# Altium project PCB_Project.PrjPcb
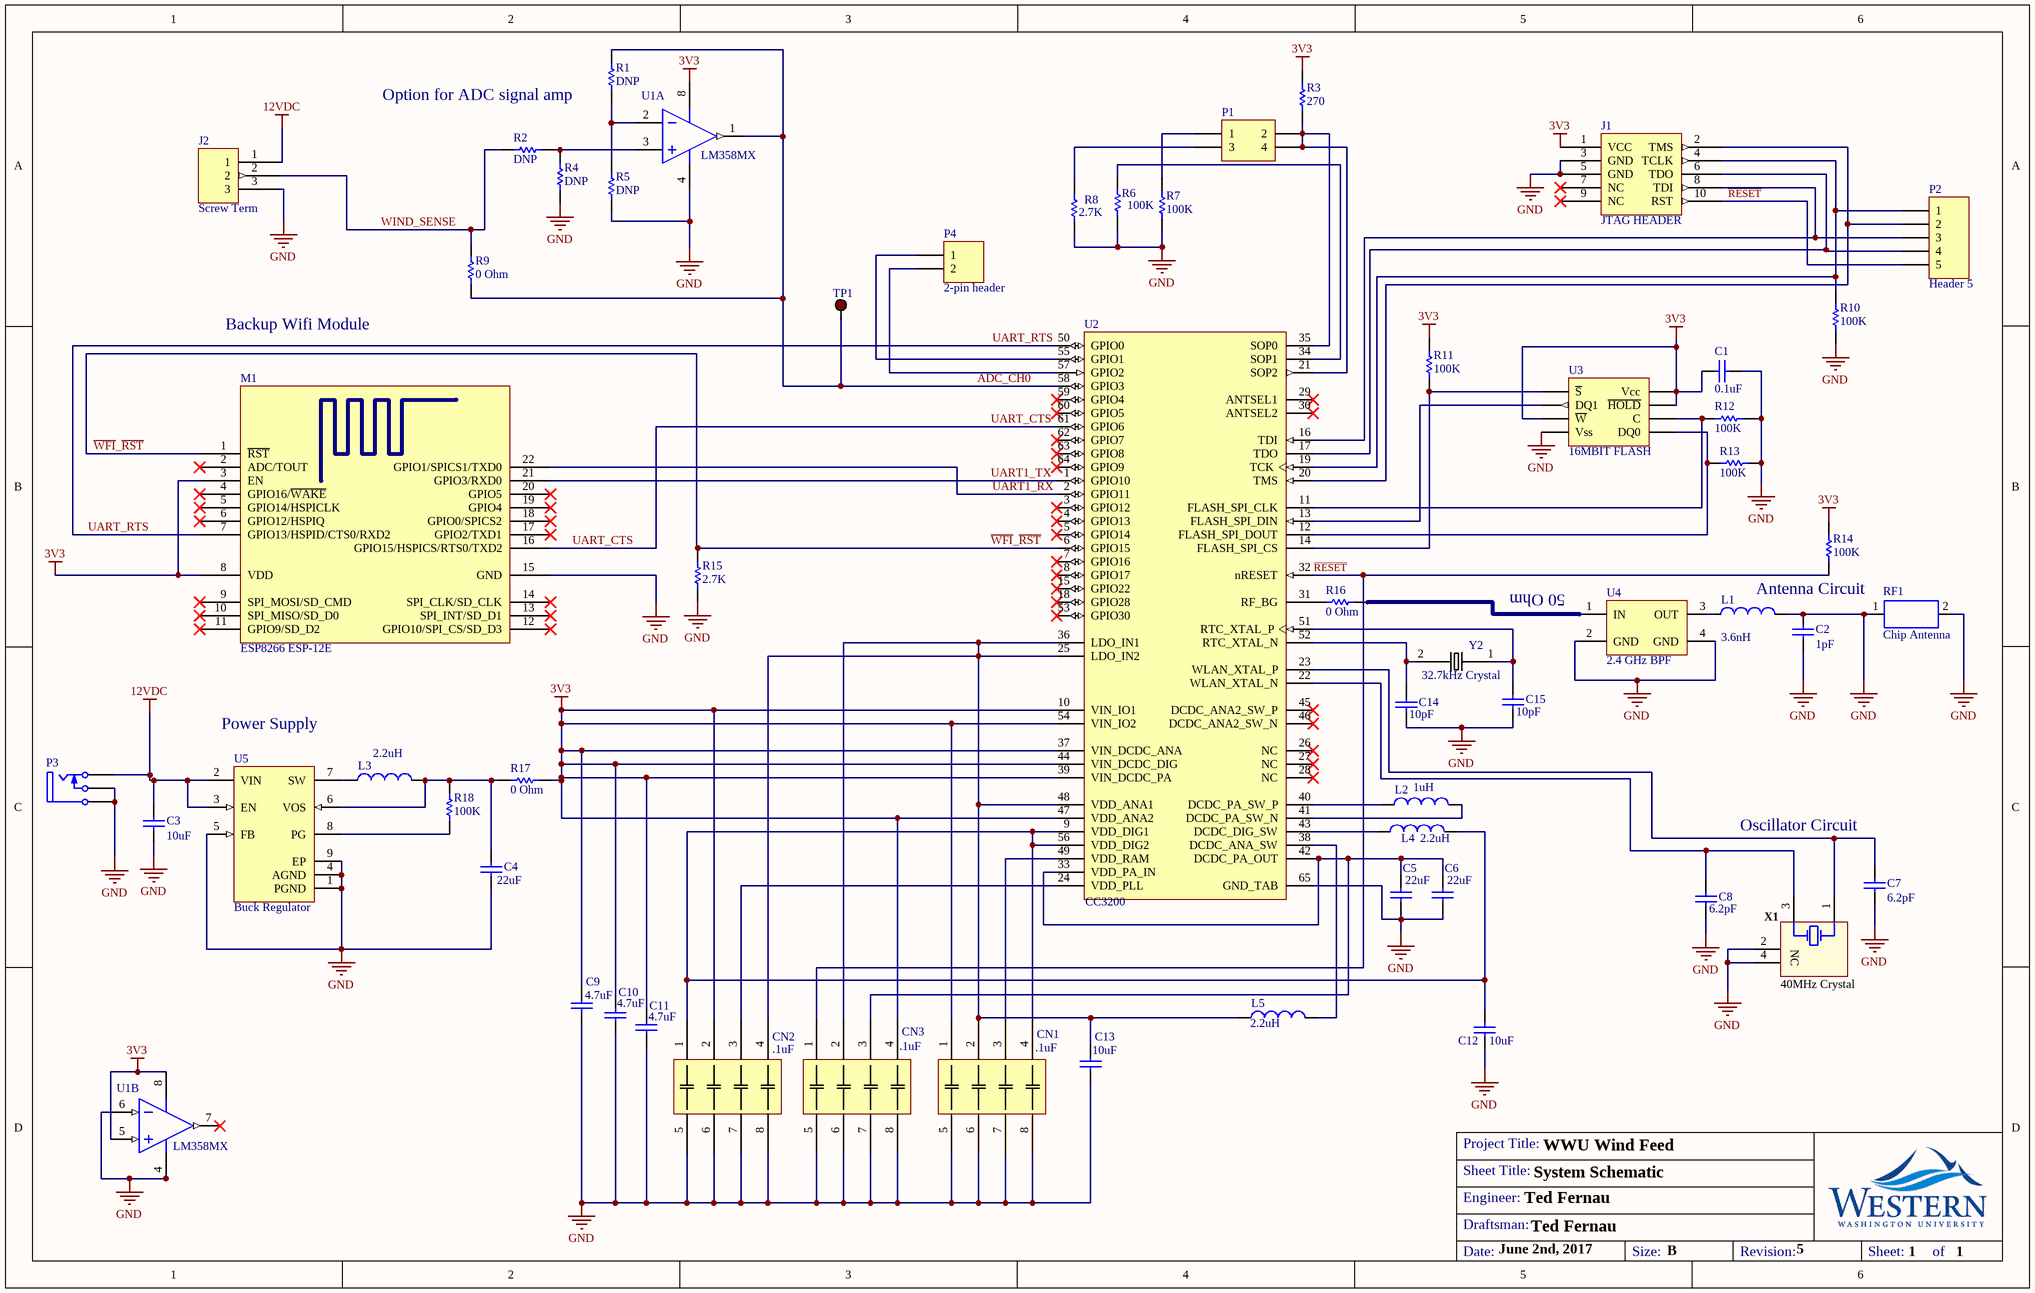
[diagram p0: System_wired.SchDoc]
RevNumber: 5; GlobalTitle: WWU Wind Feed; GlobalDate: June 2nd, 2017; EngineerName: Ted Fernau; DraftsmanName: Ted Fernau
1 sheet, 57 parts. Net scope: flat (ports and power ports of the same name join across sheets).
Board file: PCB2.PcbDoc

## Sheet System_wired.SchDoc: System Schematic
size B; Date: [Date]; Engineer: Ted Fernau; SheetNumber: 1; SheetTotal: 1; PageSetup: Record=PageOptions|CenterHorizontal=True|CenterVertical=True|PrintScale=1.09|XCorrection=1.00|YCorrection=1.00|PrintKind=1|BorderSize=5000000|LeftOffset=0|BottomOffset=0|Orientation=2|PaperLength=1000|PaperWidth=1000|Scale=100|PaperSource=15|PrintQuality=600|MediaType=1|DitherType=10|PrintScaleMode=1|PaperKind=11x17|PaperIndex=17

### Parts
C1  value 0.1uF  [CAPC0603(1608)100_M]  (hidden comment: CAP 10uF 10V 0603(1608))
C2  value 1pF  [CAPC0603(1608)100_M]  (hidden comment: CAP 10uF 10V 0603(1608))
C3  value 10uF  [CAPC0603(1608)100_M]  (hidden comment: CAP 10uF 10V 0603(1608))
C4  22uF  [CAPC0603(1608)100_L]
C5  value 22uF  [CAPC0603(1608)100_M]  (hidden comment: CAP 10uF 10V 0603(1608))
C6  value 22uF  [CAPC0603(1608)100_M]  (hidden comment: CAP 10uF 10V 0603(1608))
C7  value 6.2pF  [CAPC0603(1608)100_M]  (hidden comment: CAP 10uF 10V 0603(1608))
C8  value 6.2pF  [CAPC0603(1608)100_M]  (hidden comment: CAP 10uF 10V 0603(1608))
C9  value 4.7uF  [CAPC0603(1608)100_M]  (hidden comment: CAP 10uF 10V 0603(1608))
C10  value 4.7uF  [CAPC0603(1608)100_M]  (hidden comment: CAP 10uF 10V 0603(1608))
C11  value 4.7uF  [CAPC0603(1608)100_M]  (hidden comment: CAP 10uF 10V 0603(1608))
C12  value 10uF  [CAPC0603(1608)100_M]  (hidden comment: CAP 10uF 10V 0603(1608))
C13  value 10uF  [CAPC0603(1608)100_M]  (hidden comment: CAP 10uF 10V 0603(1608))
C14  value 10pF  [CAPC0603(1608)100_M]  (hidden comment: CAP 10uF 10V 0603(1608))
C15  value 10pF  [CAPC0603(1608)100_M]  (hidden comment: CAP 10uF 10V 0603(1608))
CN1  .1uF  [Cap. Array 0612]
CN2  .1uF  [Cap. Array 0612]
CN3  .1uF  [Cap. Array 0612]
J1  JTAG HEADER  [FTSH-105-01-L-DV-K]
J2  Screw Term  [SCREW TERM 3 PIN 3.5mm]
L1  value 3.6nH  [1608[0603]]  (hidden comment: Inductor)
L2  Inductance: 1uH  [TDK-IND0805-125_V]  (hidden comment: MLZ2012N100LT)
L3  Inductance: 2.2uH  [TDK-IND0805-125_V]  (hidden comment: MLZ2012N100LT)
L4  Inductance: 2.2uH  [TDK-IND0805-125_V]  (hidden comment: MLZ2012N100LT)
L5  Inductance: 2.2uH  [TDK-IND0805-125_V]  (hidden comment: MLZ2012N100LT)
M1  ESP8266 ESP-12E  [ESP8266 ESP-12-E]
P1  Header 2X2  [HDR2X2]  (value not drawn)
P2  Header 5  [HDR1X5]
P3  RASM722X  [SWIT-RASM722X_V]  (value not drawn)
P4  2-pin header  [HDR1X2]
R1  DNP  [RESC0603(1608)_N]
R2  DNP  [RESC0603(1608)_N]
R3  270  [RESC0805(2012)_L]
R4  DNP  [RESC0603(1608)_N]
R5  DNP  [RESC0603(1608)_N]
R6  100K  [RESC0805(2012)_L]
R7  100K  [RESC0805(2012)_L]
R8  2.7K  [RESC0805(2012)_L]
R9  0 Ohm  [RESC0603(1608)_N]
R10  100K  [RESC0805(2012)_L]
R11  100K  [RESC0805(2012)_L]
R12  100K  [RESC0805(2012)_L]
R13  100K  [RESC0805(2012)_L]
R14  100K  [RESC0805(2012)_L]
R15  2.7K  [RESC0805(2012)_L]
R16  0 Ohm  [RESC0603(1608)_N]
R17  0 Ohm  [RESC0603(1608)_N]
R18  100K  [RESC0805(2012)_L]
RF1  Chip Antenna  [TAYO-AH316M-2_N]
TP1  5001  [Keystone_5001]  (value not drawn)
U1  LM358MX  [M08A_L]  (parts A,B of 2)
U2  CC3200  [TI-RGC64-7300x7300TP_L]
U3  16MBIT FLASH  [8SOIC]
U4  2.4 GHz BPF  [TDK-DEA202450BT-1294C1-H_V]
U5  Buck Regulator  [DSG0008A_V]
X1  40MHz Crystal  [AVX-CX3225GB-4_V]
Y2  32.7kHz Crystal  [XTAL320X150X90]

### Nets
3V3: C1.2 C9.2 C10.2 C11.2 CN1.1 CN2.2 CN3.4 J1.1(VCC) M1.3(EN) M1.8(VDD) R3.2 R11.2 R14.2 R17.1 U1.5(INB+) U1.8(V+) U2.10(VIN_IO1) U2.37(VIN_DCDC_ANA) U2.39(VIN_DCDC_PA) U2.44(VIN_DCDC_DIG) U2.47(VDD_ANA2) U2.54(VIN_IO2) U3.3(~{W}) U3.7(~{HOLD}) U3.8(Vcc)
12VDC: C3.2 J2.1 P3.2(TIP) U5.2(VIN) U5.3(EN)
GND: C1.1 C2.1 C2.2 C3.1 C4.1 C5.2 C6.2 C7.1 C8.1 C9.1 C10.1 C11.1 C12.2 C13.2 C14.1 C15.1 CN1.5 CN1.6 CN1.7 CN1.8 CN2.5 CN2.6 CN2.7 CN2.8 CN3.5 CN3.6 CN3.7 CN3.8 J1.3(GND) J1.5(GND) J2.3 L1.2 M1.15(GND) P3.1(SLEEVE) P3.3(SHUNT) R4.1 R5.1 R6.1 R7.1 R8.1 R10.1 R12.1 R13.1 R15.1 RF1.1 RF1.2 U1.4(GND) U1.6(INB-) U2.65(GND_TAB) U3.4(Vss) U4.2(GND) U4.4(GND) U5.1(PGND) U5.4(AGND) U5.5(FB) U5.9(EP) X1.2(GND) X1.4(GND)
ADC_CH0: R1.2 R9.1 TP1.1(TP) U1.1(OUTA) U2.58(GPIO3)
~{RESET}: CN3.1 J1.10(RST) P2.5 R14.1 U2.32(nRESET)
UART1_RX: M1.22(GPIO1/SPICS1/TXD0) U2.2(GPIO11)
UART1_TX: M1.21(GPIO3/RXD0) U2.1(GPIO10)
UART_CTS: M1.16(GPIO15/HSPICS/RTS0/TXD2) U2.61(GPIO6)
UART_RTS: M1.7(GPIO13/HSPID/CTS0/RXD2) U2.50(GPIO0)
~{WFI}_~{RST}: M1.1(~{RST}) R15.2 U2.6(GPIO15)
WIND_SENSE: J2.2 R2.2 R9.2
NetC4_2: C4.2 L3.2 R17.2 R18.2 U5.6(VOS)
NetC5_1: C5.1 C6.1 CN3.3 U2.33(VDD_PA_IN) U2.42(DCDC_PA_OUT)
NetC7_2: C7.2 U2.23(WLAN_XTAL_P) X1.1(HOT)
NetC8_2: C8.2 U2.22(WLAN_XTAL_N) X1.3(HOT)
NetC12_1: C12.1 CN1.4 CN2.1 L4.2 U2.9(VDD_DIG1) U2.56(VDD_DIG2)
NetC13_1: C13.1 CN1.2 CN2.4 CN3.2 L5.1 U2.25(LDO_IN2) U2.36(LDO_IN1) U2.48(VDD_ANA1)
NetC14_2: C14.2 U2.52(RTC_XTAL_N) Y2.2
NetC15_2: C15.2 U2.51(RTC_XTAL_P) Y2.1
NetCN1_3: CN1.3 U2.49(VDD_RAM)
NetCN2_3: CN2.3 U2.24(VDD_PLL)
NetJ1_2: J1.2(TMS) P2.2 U2.20(TMS)
NetJ1_4: J1.4(TCLK) P2.1 R10.2 U2.19(TCK)
NetJ1_6: J1.6(TDO) P2.4 U2.17(TDO)
NetJ1_8: J1.8(TDI) P2.3 U2.16(TDI)
NetL1_1: L1.1 U4.3(OUT)
NetL2_1: L2.1 U2.40(DCDC_PA_SW_P)
NetL2_2: L2.2 U2.41(DCDC_PA_SW_N)
NetL3_1: L3.1 U5.7(SW)
NetL4_1: L4.1 U2.43(DCDC_DIG_SW)
NetL5_2: L5.2 U2.38(DCDC_ANA_SW)
NetP1_1: P1.1 R7.2
NetP1_2: P1.2 P1.4 R3.1 U2.21(SOP2) U2.35(SOP0)
NetP1_3: P1.3 R8.2
NetP4_1: P4.1 U2.55(GPIO1)
NetP4_2: P4.2 U2.57(GPIO2)
NetR1_1: R1.1 R5.2 U1.2(INA-)
NetR2_1: R2.1 R4.2 U1.3(INA+)
NetR6_2: R6.2 U2.34(SOP1)
NetR11_1: R11.1 U2.14(FLASH_SPI_CS) U3.1(~{S})
NetR12_2: R12.2 U2.11(FLASH_SPI_CLK) U3.6(C)
NetR13_2: R13.2 U2.12(FLASH_SPI_DOUT) U3.5(DQ0)
NetR16_1: R16.1 U4.1(IN)
NetR16_2: R16.2 U2.31(RF_BG)
NetR18_1: R18.1 U5.8(PG)
NetU2_13: U2.13(FLASH_SPI_DIN) U3.2(DQ1)

Not connected (* = marked no-connect by the designer): J1 7(NC)* 9(NC)*; M1 2(ADC/TOUT)* 4(GPIO16/~{WAKE})* 5(GPIO14/HSPICLK)* 6(GPIO12/HSPIQ)* 9(SPI_MOSI/SD_CMD)* 10(SPI_MISO/SD_D0)* 11(GPIO9/SD_D2)* 12(GPIO10/SPI_CS/SD_D3)* 13(SPI_INT/SD_D1)* 14(SPI_CLK/SD_CLK)* 17(GPIO2/TXD1)* 18(GPIO0/SPICS2)* 19(GPIO4)* 20(GPIO5)*; U1 7(OUTB)*; U2 3(GPIO12)* 4(GPIO13)* 5(GPIO14)* 7(GPIO16)* 8(GPIO17)* 15(GPIO22)* 18(GPIO28)* 26(NC)* 27(NC)* 28(NC)* 29(ANTSEL1)* 30(ANTSEL2)* 45(DCDC_ANA2_SW_P)* 46(DCDC_ANA2_SW_N)* 53(GPIO30)* 59(GPIO4)* 60(GPIO5)* 62(GPIO7)* 63(GPIO8)* 64(GPIO9)*

### Notes on the sheet
- (near R1) Option for ADC signal amp
- Backup Wifi Module
- 50 Ohm
- Antenna Circuit
- Power Supply
- Oscillator Circuit
- Sheet Title:
- Project Title:
- Engineer:
- Draftsman:
- Date:
- Size:
- B
- Revision:
- Sheet:        of
- (in symbol CMP-0614-00001-1) NC

### Library data of the parts
C1-C3 C5-C15 = CMP-1035-02800-1: CAP 10uF 10V ±20% 0603 (1608 Metric) Thickness 1mm SMD; Tolerance: Â±20%; Case-EIA: 0603; Case-Metric: 1608; Max Thickness: 1 mm; Rated Voltage: 10 V; Technology: SMT
C4 = CMP-1590-00005-1: 0603 (1608 Metric) Chip Capacitor; Case-Metric: 1608; Case-EIA: 0603; PackageReference: CAPC0603(1608)100; Value: 22uF
CN1-CN3 = Cap. Array 0612
J1 = JTAG 10 PIN HEADER: 10 pin 0.05" pitch header for JTAG; Supplier 1: Digi-Key; Supplier Part Number 1: FTSH-105-01-L-DV-K-TR-ND
J2 = SCREW TERM 3.5mm 3pos: Supplier 1: Digi-Key; Supplier Part Number 1: ED2741-ND
L1 = Inductor: Code_IEC: 1005; Published: 8-Jun-2000; LatestRevisionDate: 29-May-2009; LatestRevisionNote: IPC-7351 Footprint Added.; PackageReference: 0402-A; Publisher: Altium Limited; PackageDescription: Chip Inductor; Code_JEITA: 0402
L2-L5 = CMP-0266-00001-1: Multilayer Inductor, 10 uH, ±20%, 300 mOhm, 50MHz, 0805(2012); Manufacturer: TDK Corporation; Manufacturer Part Number: MLZ2012N100LTD25; DC Resistance: 0.3 Ohm; Material - Core: Ferrite; Current Rating: 500mA; Current - Saturation: 110mA; Shielding: Shielded; DC Resistance (DCR): 390 mOhm Max; Frequency - Test: 2MHz; PackageReference: IND0805-125; ComponentLink1URL: http://www.global.tdk.com/; DatasheetVersion: 05/2013; ComponentLink2Description: Datasheet; ComponentLink1Description: Manufacturer URL; Mounting Technology: Suface Mount; ComponentLink2URL: http://www.tdk.co.jp/tcfx01/c533_mlz.pdf; PartNumber: MLZ2012N100LT; PackageDescription: 2-Pin SMT Inductor, 2 x 1.25 mm Body; Supplier 1: Digi-Key; Supplier Part Number 1: 445-16376-1-ND; RoHS: RoHS Compliant; Category: Inductors, Coils, Chokes; Stock 1: 1160; Pricing 1: 1=0.18, 10=0.163, 50=0.1268, 100=0.1138, 500=0.0975, 1000=0.0845 (USD); Packaging: Cut Tape (CT); Part Status: Active; Type: Multilayer; Tolerance: ±20%; Q @ Freq: -; Frequency - Self Resonant: -; Ratings: AEC-Q200; Operating Temperature: -55°C ~ 125°C; Mounting Type: Surface Mount; Package / Case: 0805 (2012 Metric); Supplier Device Package: 0805 (2012 Metric); Size / Dimension: 0.079" L x 0.049" W (2.00mm x 1.25mm); Height - Seated (Max): 0.041" (1.05mm); ComponentLink3URL: https://product.tdk.com/info/en/catalog/datasheets/inductor_automotive_decoupling_mlz2012_en.pdf; ComponentLink3Description: https://product.tdk.com/info/en/catalog/datasheets/inductor_automotive_decoupling_mlz2012_en.pdf
M1 = ESP8266 ESP-12-E
P1 = Header 2X2: Header, 2-Pin, Dual row; LatestRevisionDate: 17-Jul-2002; LatestRevisionNote: Re-released for DXP Platform.; Publisher: Altium Limited
P2 = Header 5: Header, 5-Pin; LatestRevisionDate: 17-Jul-2002; LatestRevisionNote: Re-released for DXP Platform.; Publisher: Altium Limited
P3 = CMP-1772-00002-1: Power Jack, 5 A, 250 V, 3-Pin SMD, RoHS, Bulk; ComponentLink1URL: http://www.switchcraft.com/; ComponentLink2URL: http://www.switchcraft.com/Drawings/rasm732x_cd.pdf; ComponentLink1Description: Manufacturer URL; PackageReference: RASM722X; ComponentLink2Description: Datasheet; DatasheetVersion: Rev. A, 09/2005; PackageDescription: 3-Pin Surface Mount Device, Body 14.5 x 9 mm
P4 = Header 2: Header, 2-Pin; LatestRevisionDate: 17-Jul-2002; LatestRevisionNote: Re-released for DXP Platform.; Publisher: Altium Limited
R1 R2 R4 R5 R9 R16 R17 = CMP-1012-00001-1: Jumper 0603 (1608 Metric); Case-Metric: 1608; Value: 0.00 Ohm; Power: None; Case-EIA: 0603; Technology: SMT; Tolerance: None
R3 R6-R8 R10-R15 R18 = CMP-1013-00122-1: 100K 0.125W 5% 0805 (2012 Metric)  SMD; Case-Metric: 2012; Value: 100000.00 Ohm; Case-EIA: 0805; Tolerance: 5 %; Technology: SMT; Power: 0.125 W
RF1 = CMP-1660-00004-1: Chip Antenna, 2.4 to 2.5 GHz, -40 to 85 degC, 2-Pin SMD, Pb-Free, Tape and Reel; Resistance: 2.1 Ohm; Tolerance: 10%; Current Rating: 140 mA; Case\Package: 1210; Shielding: Unshielded; ComponentLink1Description: Manufacturer URL; Height: 2.2 mm; RoHSCompliant: true; ComponentLink1URL: http://www.t-yuden.com/; Width: 0.098 inch; Max Operating Temperature: 100 degC; REACH SVHC: No SVHC; DatasheetVersion: Sep-15; Packaging: Tape and Reel; ComponentLink2Description: Datasheet; Case Code (Metric): 3225; PackageReference: AH316M-2; Length: 0.126 inch; Radiation Hardening: No; Mount: Surface Mount; Package Quantity: 1; Min Operating Temperature: -20 degC; Case Code (Imperial): 1210; ComponentLink2URL: http://www.yuden.co.jp/productdata/catalog/en/chipantenna01_e.pdf; Pins: 2; PackageDescription: 2-Pin Surface Mount Device, Body 3.2 x 1.6 mm
TP1 = TEST POINT: TEST POINT PC MINI .040"D BLACK; Manufacturer: Keystone Electronics; Supplier 1: Digi-Key; Manufacturer Part Number: 5001; RoHS: RoHS Compliant; Category: Test and Measurement; Stock 1: 7538; Pricing 1: 1=0.34, 10=0.315, 50=0.2296, 100=0.2206, 250=0.19812, 500=0.1891, 1000=0.15759, 2500=0.14408, 5000=0.13508 (USD); Packaging: Bulk; Type: PC Test Point, Miniature; Terminal: 0.010" x 0.020" (0.25mm x 0.51mm) Phosphor Bronze Wire, Silver Plated; Mounting Type: 0.040" (1.02mm) Hole Diameter; Material: Base, Nylon 46, UL 94V-0; Color: Black; ComponentLink1URL: http://www.keyelco.com/product-pdf.cfm?p=1310; ComponentLink1Description: http://www.keyelco.com/product-pdf.cfm?p=1310; Supplier Part Number 1: 5001K-ND
U1 = CMP-0055-00630-1: Low Power Dual Operational Amplifier, 8-pin Narrow SOIC; Manufacturer: National Semiconductor; PackageTopMarking: NSZXTT*LM*358M; CompType: Amplifiers; PowerWise: N; PinCount: 8; RoHS: N; Code_JEDEC: MS-012-AA; DatasheetVersion: Oct-2005; PackageDescription: SOIC Narrow, 4.9 x 3.9 x 1.45mm, 8 Lead, 1.27mm Pitch; PackageVersion: revM, May-2009; PackageReference: M08A; Code_IPC: SOIC127P600-8; PartId: 1
U2 = CMP-1530-00002-1: SimpleLink Wi-Fi and Internet-of-Things Solution, a Single-Chip Wireless MCU, 2.1 to 3.6 V, -40 to 85 degC, 64-Pin PQFN (RGC64), Green (RoHS & no Sb/Br), Tray; PartNumber: CC3200R1M2RGC; Manufacturer: Texas Instruments; Peak Calibration Current@VBAT: 2.1 V=670 mA Typ.; RAM: 256 kB Max.; Sensitivity@1 DSSS: -95.7 dBm; RF Family/Standard: WiFi; Protocol: 802.11b/g/n; Modulation: DSSS, OFDM; Frequency: 2.4GHz; Data Rate (Max): 54Mbps; Power - Output: 18.3dBm; Sensitivity: -95.7dBm; Memory Size: 256kB RAM, 64kB ROM; Serial Interfaces: I²C, I²S, JTAG, SPI, UART; GPIO: 27; Voltage - Supply: 2.1 V ~ 3.6 V; Current - Receiving: 53mA ~ 59mA; PackageDescription: 64-Pin Plastic Quad Flatpack No-Lead, Body 9 x 9 mm, Pitch 0.5 mm; ComponentLink1Description: Manufacturer URL; DatasheetVersion: SWAS032F; Temperature Range: -40 to 85 degC; Mounting Technology: Surface Mount; ComponentLink2Description: Datasheet; ComponentLink3Description: Package Specification; ComponentLink2URL: http://www.ti.com/lit/ds/symlink/cc3200.pdf; RoHS: TRUE; Packing: Tray; VBAT: 2.1 to 3.6 V; ComponentLink3URL: http://www.ti.com/lit/ml/mpqf125e/mpqf125e.pdf; ComponentLink1URL: www.ti.com; PackageVersion: 4204106/F; Supplier 1: Digi-Key; Supplier Part Number 1: 296-38012-ND; Manufacturer Part Number: CC3200R1M2RGC; Category: RF/IF and RFID; Stock 1: 1853; Pricing 1: 1=12.16, 10=11.175, 100=9.4377, 500=8.3955, 1000=7.7007, 2500=7.4112, 5000=7.2375 (USD); Packaging: Tray; Part Status: Active; Type: TxRx + MCU; Current - Transmitting: 53mA ~ 59mA; Operating Temperature: -40°C ~ 85°C; Package / Case: 64-VFQFN Exposed Pad
U3 = FLASH SPI 16MBIT: 16 MBIT FLASH SPI 8SOIC; Supplier 1: Digi-Key; Supplier Part Number 1: M25P16-VMN6TP CT-ND
U4 = CMP-1663-00013-1: 2.4 GHz Filter; Case\Package: 0603; Resistance: 22 kohm; Tolerance: 1%; Voltage Rating: 75 V; Power Rating: 100 mW; Width: 0.8 mm; Height: 0.45 mm; Case Code (Metric): 1608; DatasheetVersion: Jun-15; Length: 1.6 mm; ComponentLink2URL: https://product.tdk.com/info/en/documents/data_sheet/rf_bpf_dea202450bt-1294c1-h_en.pdf; Package Quantity: 5000; Max Operating Temperature: 155 degC; Case Code (Imperial): 0603; ComponentLink2Description: Datasheet; Min Operating Temperature: -55 degC; Pins: 2; Radiation Hardening: No; Mount: Surface Mount; Packaging: Tape and Reel; PackageDescription: 4-Pin Surface Mount Device, Body 2 x 1.25 mm; ComponentLink1Description: Manufacturer URL; ComponentLink1URL: http://www.tdk.com/; PackageReference: DEA202450BT-1294C1-H; REACH SVHC: Yes; RoHSCompliant: true
U5 = CMP-0323-00337-3: Buck Step Down Regulator with 3 to 17 V Input and 3.3 V Output, -40 to 85 degC, 8-Pin WSON (DSG), Green (RoHS & no Sb/Br); Manufacturer: Texas Instruments; PartNumber: TPS62172DSGR; Vout(Max)(V): 3.3; Iq(Typ)(mA): 0.017; Switch Current Limit(Typ)(A): 1.05; Regulated Outputs(#): 1; Vin(Min)(V): 3; Duty Cycle(Max)(%): 100; Iout(Max)(A): 0.5; Synchronous Rectification: TRUE; SubFamily: Step-Down Regulator; Rating: Catalog; Vin(Max)(V): 17; Function: Step-Down; Output Configuration: Positive; Output Type: Fixed; Voltage - Input (Min): 3V; Voltage - Input (Max): 17V; Voltage - Output (Min/Fixed): 3.3V; Current - Output: 500mA; Frequency - Switching: 2.25MHz; Synchronous Rectifier: Yes; Eco-Plan: Green (RoHS & no Sb/Br); ComponentLink1URL: http://www.ti.com/general/docs/lit/getliterature.tsp?genericPartNumber=TPS62172&fileType=pdf; Code_JEDEC: MO-229; ComponentLink3Description: URL Link1; ComponentLink2URL: http://www.ti.com/litv/pdf/mpds308a; Mounting Technology: Surface Mount; Preset Vout(V): 3.3; ComponentLink1Description: Datasheet; PackageVersion: revB, Oct-2010; PackageReference: DSG0008A; Topology: Buck; DatasheetVersion: SLVSAT8A; ComponentLink3URL: Samples URL:http://www.ti.com/product/tps62172#samples; PackageDescription: 8-Pin Plastic Small Outline No-Lead, 2 x 2 x 0.8 mm Body, 0.5 mm Pitch, Exposed Pad; ComponentLink2Description: Package Specification; Vout(Min)(V): 3.3; Supplier 1: Digi-Key; Supplier Part Number 1: 296-39449-1-ND; Manufacturer Part Number: TPS62172DSGR; RoHS: RoHS Compliant; Category: Integrated Circuits (ICs); Stock 1: 15892; Pricing 1: 1=1.56, 10=1.395, 100=1.0878, 500=0.89964, 1000=0.57375 (USD); Packaging: Cut Tape (CT); Part Status: Active; Number of Outputs: 1; Voltage - Output (Max): -; Operating Temperature: -40°C ~ 85°C (TA); Mounting Type: Surface Mount; Package / Case: 8-WFDFN Exposed Pad; Supplier Device Package: 8-WSON (2x2); ComponentLink4URL: http://www.ti.com/lit/ds/symlink/tps62171.pdf; ComponentLink4Description: http://www.ti.com/lit/ds/symlink/tps62171.pdf
X1 = CMP-0614-00001-1: Crystal Unit, 8 pF, 25000 kHz, -10 to 70 degC, 4-Pin 3.2 x 2.5 x 0.8 mm SMD, RoHS, Tape and Reel; Manufacturer: Kyocera; PartNumber: CX3225GB25000D0HEQCC; Load Capacitance: 8 pF; Frequency Tolerance: +/- 20 x 10^(-6); Operationg Temperature: -10 to 70 degC; PackageDescription: 4-Pin SMT, Body 3.2 x 2.5 mm, Height 0.9 mm; PackageVersion: Sep-13; PackageReference: CX3225GB-4; ComponentLink2Description: Datasheet; Series: CX3225GB; DatasheetVersion: Sep-13; ComponentLink2URL: http://global.kyocera.com/prdct/electro/pdf/xtal/cx3225gb_cs_e.pdf; ComponentLink3Description: Package Specification; ComponentLink1URL: http://global.kyocera.com/; ComponentLink3URL: http://global.kyocera.com/prdct/electro/pdf/xtal/cx3225gb_cs_e.pdf; Mounting Technology: Surface Mount; Frequency: 25000 kHz; Packing: Tape and Reel; ComponentLink1Description: Manufacturer URL; RoHS: TRUE
Y2 = ABS07-32.768KHZ-T: ABS07 Series 32.768 kHz %C2%B120 ppm 12.5 pF -40 to %2B85 %C2%B0C SMT Low Profile Crystal; MF: Abracon; Package: 0805 Abracon; Availability: Good; MP: ABS07-32.768KHZ-T; Price: 0.44 USD; Value: *